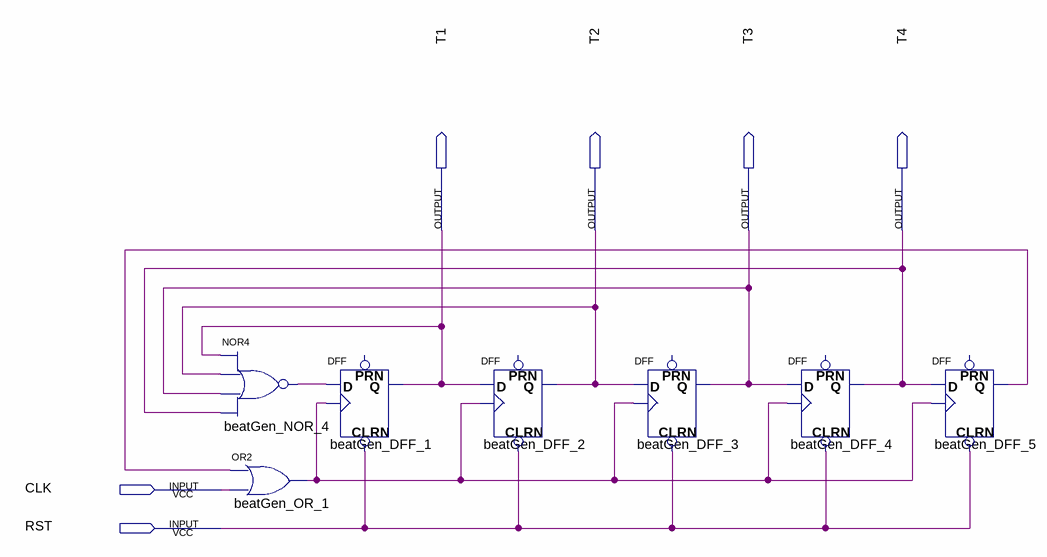
[diagram p0: schematic sheet]
// Quartus schematic beatGen.bdf as structural Verilog: 7 symbols, 6 pins
module beatGen (
  input  CLK,
  input  RST,
  output T1,
  output T2,
  output T3,
  output T4
);

  wire beatGen_DFF_5_q, beatGen_NOR_4_out, beatGen_OR_1_out;

  nor beatGen_NOR_4 (beatGen_NOR_4_out, T1, T2, T3, T4);
  or beatGen_OR_1 (beatGen_OR_1_out, beatGen_DFF_5_q, CLK);
  DFF beatGen_DFF_1 (.CLRN(RST), .CLK(beatGen_OR_1_out), .D(beatGen_NOR_4_out), .Q(T1));  // open: PRN
  DFF beatGen_DFF_2 (.CLRN(RST), .CLK(beatGen_OR_1_out), .D(T1), .Q(T2));  // open: PRN
  DFF beatGen_DFF_3 (.CLRN(RST), .CLK(beatGen_OR_1_out), .D(T2), .Q(T3));  // open: PRN
  DFF beatGen_DFF_4 (.CLRN(RST), .CLK(beatGen_OR_1_out), .D(T3), .Q(T4));  // open: PRN
  DFF beatGen_DFF_5 (.CLRN(RST), .CLK(beatGen_OR_1_out), .D(T4), .Q(beatGen_DFF_5_q));  // open: PRN
endmodule
